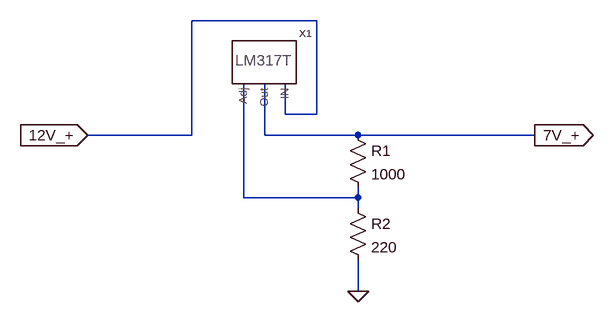
[diagram p0: schematic 7v_Regulator.asc]
7v_Regulator.asc, the LTspice schematic file:
Version 4
SHEET 1 880 680
WIRE 288 64 96 64
WIRE 240 208 240 160
WIRE 288 208 288 64
WIRE 288 208 240 208
WIRE 96 240 96 64
WIRE 96 240 -64 240
WIRE 208 240 208 160
WIRE 352 240 208 240
WIRE 624 240 352 240
WIRE 176 336 176 160
WIRE 352 336 352 320
WIRE 352 336 176 336
WIRE 352 352 352 336
WIRE 352 480 352 432
FLAG 624 240 7V_+
IOPIN 624 240 Out
FLAG -64 240 12V_+
IOPIN -64 240 In
FLAG 352 480 0
SYMBOL LM317T 240 128 R0
SYMATTR InstName X1
SYMBOL res 336 224 R0
SYMATTR InstName R1
SYMATTR Value 1000
SYMBOL res 336 336 R0
SYMATTR InstName R2
SYMATTR Value 220

The netlist it stands for:
* 7v_Regulator.asc
XX1 N001 7V_+ 12V_+ LM317T  ; pins Adj Out IN
R1 7V_+ N001 1000
R2 N001 0 220
.backanno
.end